# EAGLE design 114_uv (EAGLE 7.6.0)
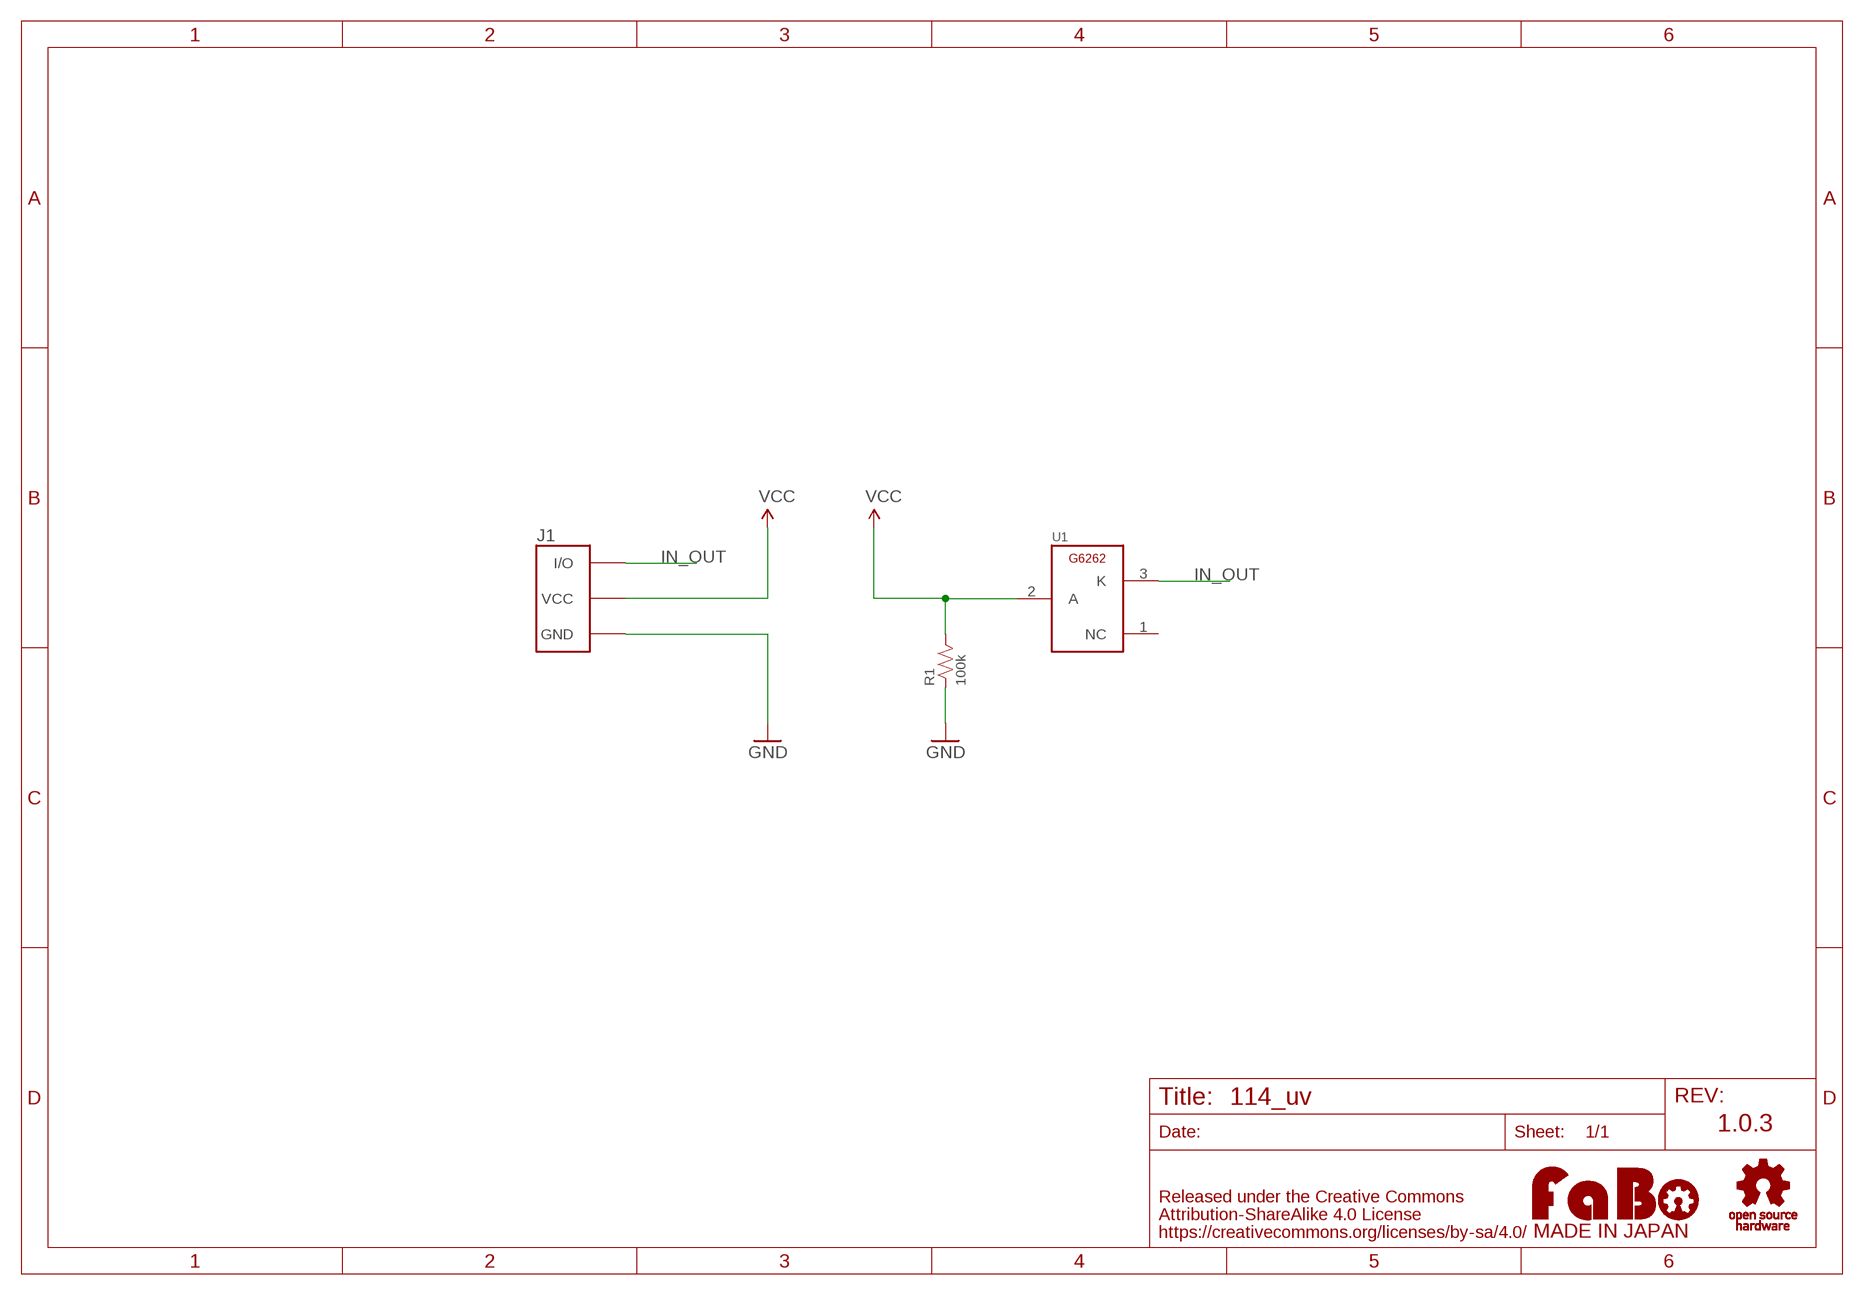
[diagram p0: schematic, sheet 1]

## Parts
J1  FABO_BRICK_3PIN  [FABO_BRICK_3PIN]
R1  100k  RESISTOR-0603  [0603]
U1  HAMAMATSU-GAASP-G6262  [GAASP-G6262]
U$2  LOGO_OSHW-M_BOTTOM  [LOGO_OSHW_M_BOTTOM]
U$3  LOGO_FABO-M  [LOGO_FABO_MS]

## Nets
GND: J1.GND R1.1
IN_OUT: J1.I/O U1.3(K)
VCC: J1.VCC R1.2 U1.2(A)
Unconnected: U1.1(NC)

## Notes on the sheet
- 1.0.3

## Library data of the parts
J1 = FaBo-Template:FABO_BRICK_3PIN: FaBo Brick 3pin
R1 = FaBo-Resistors:RESISTOR: RESISTOR
U1 = FaBo-Sensor:HAMAMATSU-GAASP-G6262: GaAsP G6262
U$2 = FaBo-etc:LOGO_OSHW
U$3 = FaBo-etc:LOGO_FABO

## Board
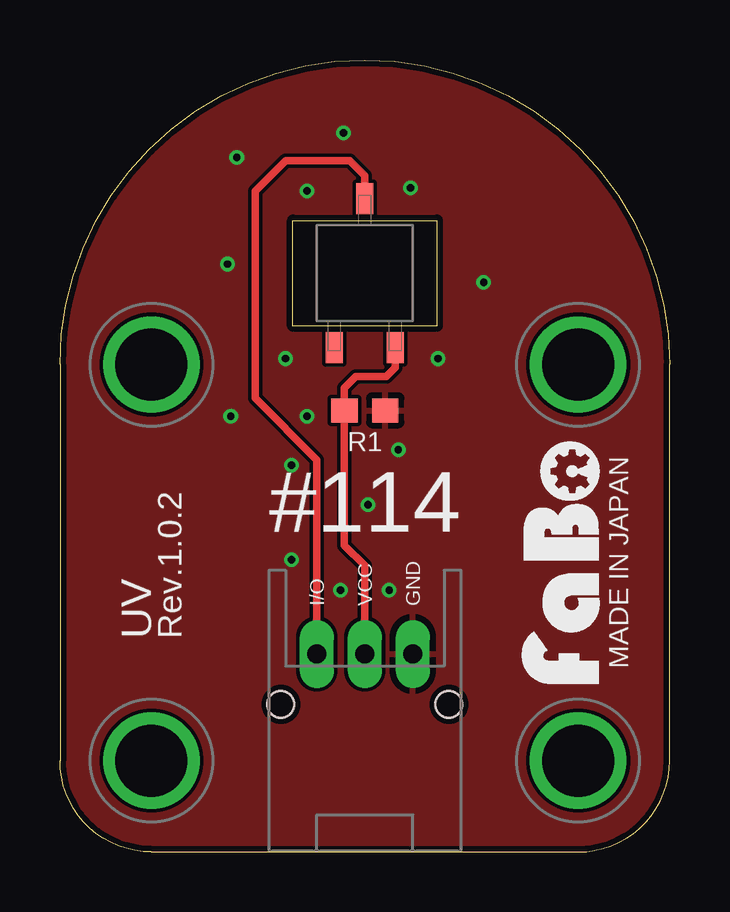
[diagram p1: board, top side]
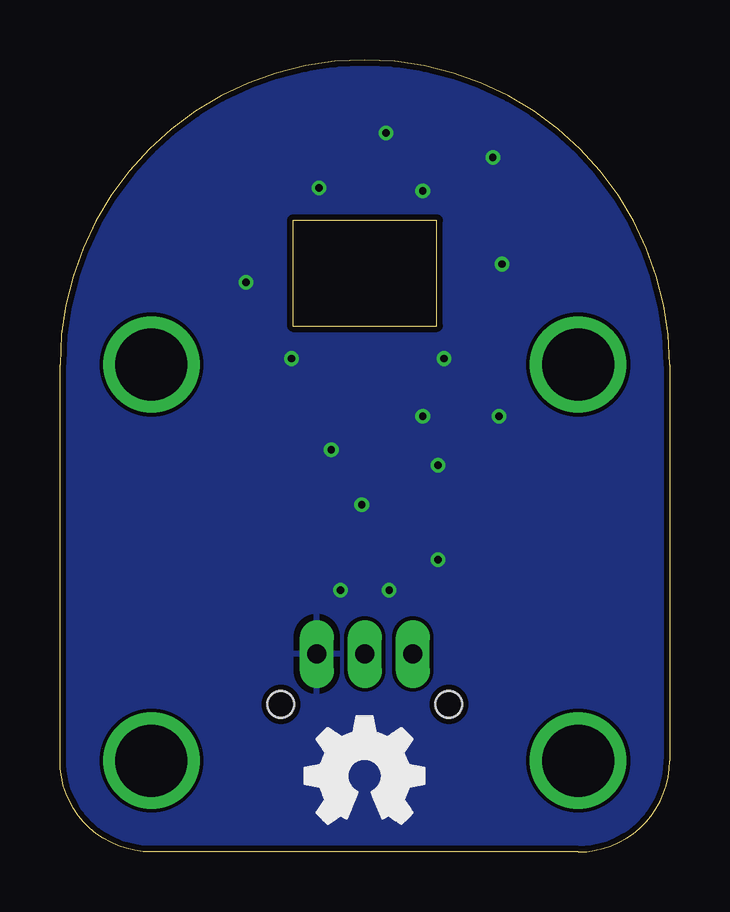
[diagram p2: board, bottom side, seen from below]

Size 25.4 x 33.02 mm. Coordinates in mm from the lower left corner, seen from the top.
Copper layers (1*16): Top 0.035mm / dielectric 1.5mm / Bottom 0.035mm
Design rules "SeeedStudio_2layer_DRU_no_angle_20140221": minimum track width 6mil, minimum drill 12mil, track to track 6mil, track to pad 6mil, pad to pad 6mil, via to via 6mil, smd to smd 0mil, copper to edge 10mil, drill to drill 10mil, minimum pad ring 10mil, minimum via ring 6mil, stop-mask expansion 2mil, vias tented up to drill 100mil, thermal gap 10mil

### Footprints (pad centres in the part's own frame; a part is rotated, then mirrored left to right if it is on the bottom)
FABO_BRICK_3PIN = drill 0.8 pad 1.422 long: GND 2,-8.255; I/O -2,-8.255; VCC 0,-8.255 | drill 3 pad 3.81: P$1 -8.89,3.81; P$2 8.89,3.81; P$3 -8.89,-12.7; P$4 8.89,-12.7 | hole 1.1: -3.5,-10.355; 3.5,-10.355
0603 = smd 1.1 x 1: 1 -0.85,0; 2 0.85,0
GAASP-G6262 = smd 0.7 x 1.3: 1 -1.27,-3.104; 2 1.27,-3.104; 3 0,3.104

### Placement (x,y rotation side)
J1  12.7,16.51 0 top
R1  12.7,18.41 180 top
U1  12.7,24.13 0 top
U$2  12.7,3.17 0 top
U$3  22.86,12.06 90 top

### Tracks (layer width: path | path; a pad name or v marks a point on that pad's centre or on a via)
GND  (via drill 0.3)
  other vias: 10.29,18.16 9.4,20.57 10.29,27.56 14.61,27.69 15.75,20.57 14.1,16.76 9.65,16.13 9.65,12.19 11.68,10.92 13.72,10.92 12.83,14.48 6.99,24.51 7.11,18.16 7.37,28.96 11.81,29.97 17.65,23.75
  pour Bottom: 0,0 25.4,0 25.4,33.02 0,33.02
  pour Top: 0,0 25.4,0 25.4,33.02 0,33.02
IN_OUT
  Top 0.305: J1.I/O 10.7,16.35 8.13,18.92 8.13,27.56 9.4,28.83 12.06,28.83 12.7,28.19 U1.3
VCC
  Top 0.305: J1.VCC 12.7,11.94 11.85,12.79 R1.2 11.85,19.34 12.32,19.81 13.59,19.81 13.97,20.19 U1.2

### Text on the board
tPlace: #114 | MADE IN JAPAN | UV | Rev.1.0.2